# Altium schematic sheet Driver.SchDoc
size 457 x 289 mm
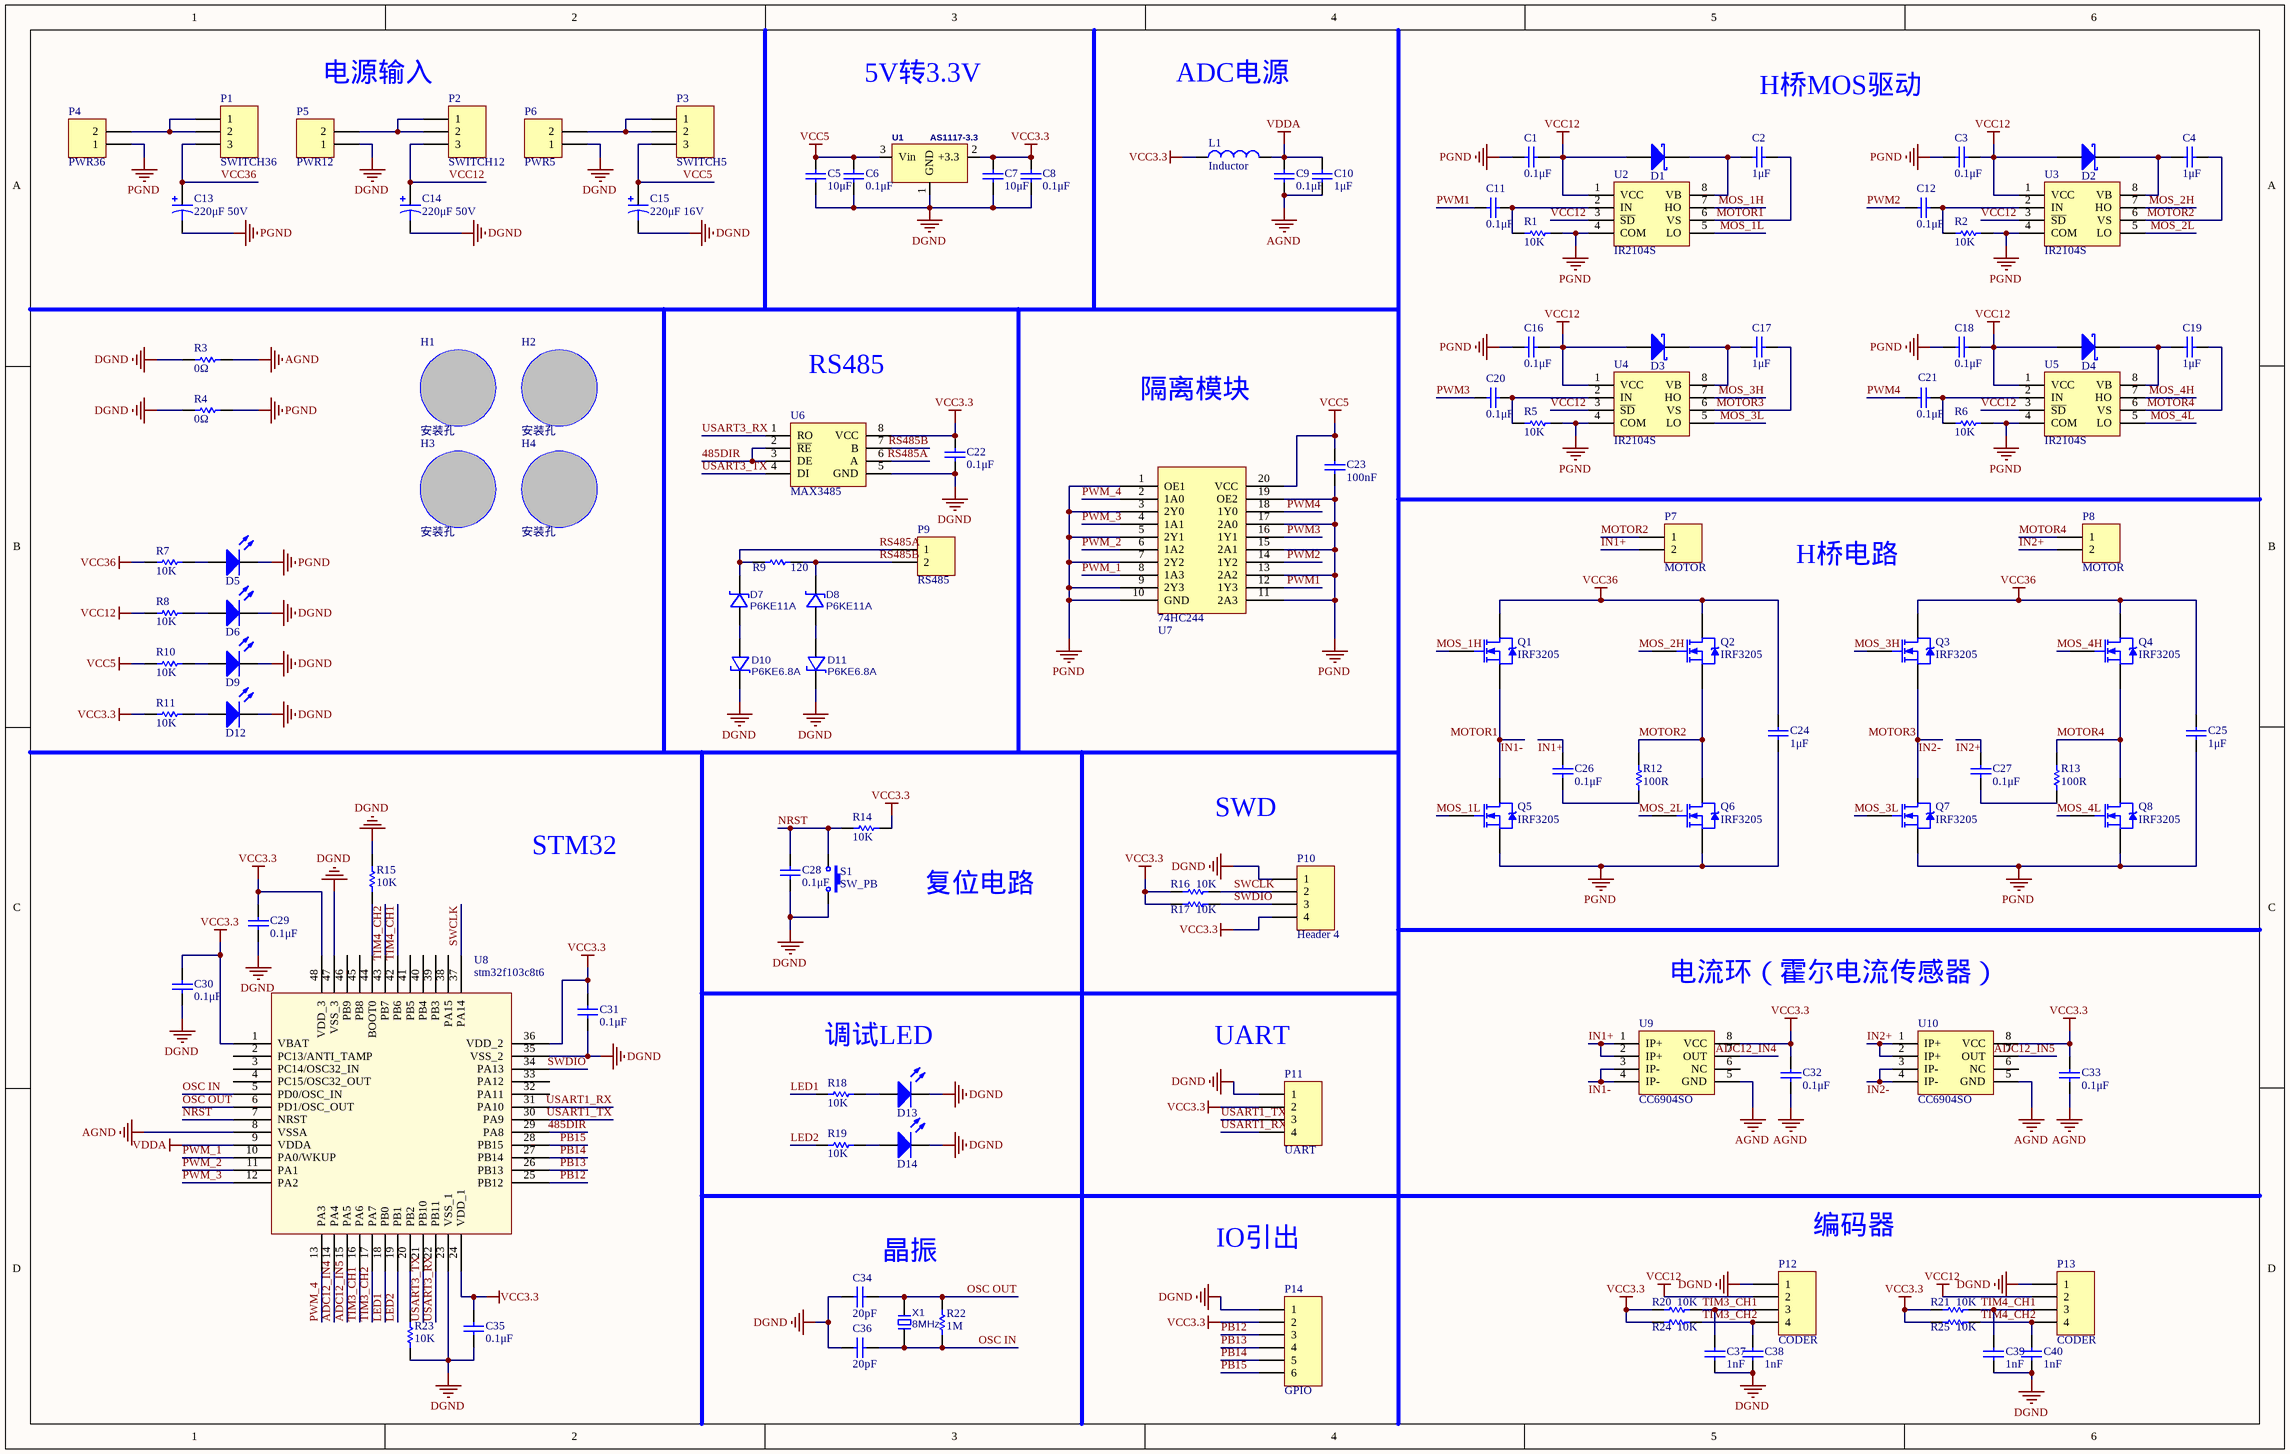
[diagram p0: Driver.SchDoc]

## Parts
C1  0.1μF  [0603C]
C2  1μF  [0603C]
C3  0.1μF  [0603C]
C4  1μF  [0603C]
C5  10μF  [0603C]
C6  0.1μF  [0603C]
C7  10μF  [0603C]
C8  0.1μF  [0603C]
C9  0.1μF  [0603C]
C10  1μF  [0603C]
C11  0.1μF  [0603C]
C12  0.1μF  [0603C]
C13  220μF 50V  [CAP-TH_BD10.0-P5.00-D1.0-FD]
C14  220μF 50V  [CAP-TH_BD10.0-P5.00-D1.0-FD]
C15  220μF 16V  [CAP-TH_BD6.3-P2.50-D1.0-FD]
C16  0.1μF  [0603C]
C17  1μF  [0603C]
C18  0.1μF  [0603C]
C19  1μF  [0603C]
C20  0.1μF  [0603C]
C21  0.1μF  [0603C]
C22  0.1μF  [0603C]
C23  100nF  [0603C]
C24  1μF  [C1206]
C25  1μF  [C1206]
C26  0.1μF  [0603C]
C27  0.1μF  [0603C]
C28  0.1μF  [0603C]
C29  0.1μF  [0603C]
C30  0.1μF  [0603C]
C31  0.1μF  [0603C]
C32  0.1μF  [0603C]
C33  0.1μF  [0603C]
C34  20pF  [0603C]
C35  0.1μF  [0603C]
C36  20pF  [0603C]
C37  1nF  [6-0805_N]
C38  1nF  [6-0805_N]
C39  1nF  [6-0805_N]
C40  1nF  [6-0805_N]
D1  D-SS12  [SMA_L4.4-W2.6-LS5.0-RD]  (value not drawn)
D2  D-SS12  [SMA_L4.4-W2.6-LS5.0-RD]  (value not drawn)
D3  D-SS12  [SMA_L4.4-W2.6-LS5.0-RD]  (value not drawn)
D4  D-SS12  [SMA_L4.4-W2.6-LS5.0-RD]  (value not drawn)
D5  LED_0603  [0603D]  (value not drawn)
D6  LED_0603  [0603D]  (value not drawn)
D7  P6KE11A  [SMB]
D8  P6KE11A  [SMB]
D9  LED_0603  [0603D]  (value not drawn)
D10  P6KE6.8A  [SMB]
D11  P6KE6.8A  [SMB]
D12  LED_0603  [0603D]  (value not drawn)
D13  LED_0603  [0603D]  (value not drawn)
D14  LED_0603  [0603D]  (value not drawn)
H1  安装孔  [安装孔]
H2  安装孔  [安装孔]
H3  安装孔  [安装孔]
H4  安装孔  [安装孔]
L1  Inductor  [0603L]
P1  SWITCH36  [船型开关]
P2  SWITCH12  [钮子开关]
P3  SWITCH5  [SWITCH_SS-12F44]
P4  PWR36  [KF301]
P5  PWR12  [HDR1X2]
P6  PWR5  [HDR1X2]
P7  MOTOR  [KF301]
P8  MOTOR  [KF301]
P9  RS485  [HDR1X2]
P10  Header 4  [HDR1X4]
P11  UART  [HDR1X4]
P12  CODER  [HDR1X4]
P13  CODER  [HDR1X4]
P14  GPIO  [HDR1X6]
Q1  IRF3205  [IRF3205_D2PAK]
Q2  IRF3205  [IRF3205_D2PAK]
Q3  IRF3205  [IRF3205_D2PAK]
Q4  IRF3205  [IRF3205_D2PAK]
Q5  IRF3205  [IRF3205_D2PAK]
Q6  IRF3205  [IRF3205_D2PAK]
Q7  IRF3205  [IRF3205_D2PAK]
Q8  IRF3205  [IRF3205_D2PAK]
R1  10K  [0603R]
R2  10K  [0603R]
R3  0Ω  [0603R]
R4  0Ω  [0603R]
R5  10K  [0603R]
R6  10K  [0603R]
R7  10K  [0603R]
R8  10K  [0603R]
R9  120  [0603R]
R10  10K  [0603R]
R11  10K  [0603R]
R12  100R  [0603R]
R13  100R  [0603R]
R14  10K  [0603R]
R15  10K  [0603R]
R16  10K  [0603R]
R17  10K  [0603R]
R18  10K  [0603R]
R19  10K  [0603R]
R20  10K  [0603R]
R21  10K  [0603R]
R22  1M  [0603R]
R23  10K  [0603R]
R24  10K  [0603R]
R25  10K  [0603R]
S1  SW_PB  [SMD_6MM*3MM]
U1  AS1117-3.3  [SOT223_N]
U2  IR2104S  [SO8_N]
U3  IR2104S  [SO8_N]
U4  IR2104S  [SO8_N]
U5  IR2104S  [SO8_N]
U6  MAX3485  [SO8_N]
U7  74HC244  [SOIC-20_L13.3-W7.5-P1.27-LS7.8-BL]  (value not drawn)
U8  stm32f103c8t6  [STM-LQFP48_N]
U9  CC6904SO  [SO8_N]
U10  CC6904SO  [SO8_N]
X1  8MHz  [HC-49US_L11.5-W4.5-P4.88]

## Nets
AGND: C9.1 C10.1 C32.1 C33.1 R3.1 U8.8(VSSA) U9.5(GND) U10.5(GND)
DGND: C5.1 C6.1 C7.1 C8.1 C14.2 C15.2 C22.2 C28.1 C29.1 C30.1 C31.1 C34.2 C35.1 C36.2 C37.1 C38.1 C39.1 C40.1 D6.2(K) D9.2(K) D10.2(K) D11.2(K) D12.2(K) D13.2(K) D14.2(K) P5.1 P6.1 P10.1 P11.1 P12.1 P13.1 P14.1 R3.2 R4.2 R15.1 R23.2 S1.2 U1.1(GND) U6.5(GND) U8.23(VSS_1) U8.35(VSS_2) U8.47(VSS_3)
PGND: C1.1 C3.1 C13.2 C16.1 C18.1 C23.2 C24.1 C25.1 D5.2(K) P4.1 Q5.3(S) Q6.3(S) Q7.3(S) Q8.3(S) R1.1 R2.1 R4.1 R5.1 R6.1 U2.4(COM) U3.4(COM) U4.4(COM) U5.4(COM) U7.1(OE1) U7.3(2Y0) U7.5(2Y1) U7.7(2Y2) U7.9(2Y3) U7.10(GND) U7.11(2A3) U7.13(2A2) U7.15(2A1) U7.17(2A0) U7.19(OE2)
VCC3.3: C7.2 C8.2 C22.1 C29.2 C30.2 C31.2 C32.2 C33.2 C35.2 L1.1 P10.4 P11.2 P14.2 R11.2 R14.1 R16.1 R17.1 R20.2 R21.2 R24.2 R25.2 U1.2(+3.3) U6.8(VCC) U8.1(VBAT) U8.24(VDD_1) U8.36(VDD_2) U8.48(VDD_3) U9.8(VCC) U10.8(VCC)
VCC5: C5.2 C6.2 C15.1 C23.1 P3.3 R10.2 U1.3(Vin) U7.20(VCC)
VCC12: C1.2 C3.2 C14.1 C16.2 C18.2 D1.1(A) D2.1(A) D3.1(A) D4.1(A) P2.3 P12.2 P13.2 R8.2 U2.1(VCC) U2.3(~{SD}) U3.1(VCC) U3.3(~{SD}) U4.1(VCC) U4.3(~{SD}) U5.1(VCC) U5.3(~{SD})
VCC36: C13.1 C24.2 C25.2 P1.3 Q1.2(D) Q2.2(D) Q3.2(D) Q4.2(D) R7.2
VDDA: C9.2 C10.2 L1.2 U8.9(VDDA)
485DIR: U6.2(~{RE}) U6.3(DE) U8.29(PA8)
ADC12_IN4: U8.14(PA4) U9.7(OUT)
ADC12_IN5: U8.15(PA5) U10.7(OUT)
IN1+: C26.2 P7.2 U9.1(IP+) U9.2(IP+)
IN1-: C2.2 Q1.3(S) Q5.2(D) U2.6(VS) U9.3(IP-) U9.4(IP-)  [also labelled MOTOR1]
IN2+: C27.2 P8.2 U10.1(IP+) U10.2(IP+)
IN2-: C17.2 Q3.3(S) Q7.2(D) U4.6(VS) U10.3(IP-) U10.4(IP-)  [also labelled MOTOR3]
LED1: R18.2 U8.18(PB0)
LED2: R19.2 U8.19(PB1)
MOS_1H: Q1.1(G) U2.7(HO)
MOS_1L: Q5.1(G) U2.5(LO)
MOS_2H: Q2.1(G) U3.7(HO)
MOS_2L: Q6.1(G) U3.5(LO)
MOS_3H: Q3.1(G) U4.7(HO)
MOS_3L: Q7.1(G) U4.5(LO)
MOS_4H: Q4.1(G) U5.7(HO)
MOS_4L: Q8.1(G) U5.5(LO)
MOTOR2: C4.2 P7.1 Q2.3(S) Q6.2(D) R12.2 U3.6(VS)
MOTOR4: C19.2 P8.1 Q4.3(S) Q8.2(D) R13.2 U5.6(VS)
NRST: C28.2 R14.2 S1.1 U8.7(NRST)
OSC IN: C36.1 R22.2 U8.5(PD0/OSC_IN) X1.1
OSC OUT: C34.1 R22.1 U8.6(PD1/OSC_OUT) X1.2
PB12: P14.3 U8.25(PB12)
PB13: P14.4 U8.26(PB13)
PB14: P14.5 U8.27(PB14)
PB15: P14.6 U8.28(PB15)
PWM1: C11.1 U7.12(1Y3)
PWM2: C12.1 U7.14(1Y2)
PWM3: C20.1 U7.16(1Y1)
PWM4: C21.1 U7.18(1Y0)
PWM_1: U7.8(1A3) U8.10(PA0/WKUP)
PWM_2: U7.6(1A2) U8.11(PA1)
PWM_3: U7.4(1A1) U8.12(PA2)
PWM_4: U7.2(1A0) U8.13(PA3)
RS485A: D7.2(K) P9.1 R9.1 U6.6(A)
RS485B: D8.2(K) P9.2 R9.2 U6.7(B)
SWCLK: P10.2 R16.2 U8.37(PA14)
SWDIO: P10.3 R17.2 U8.34(PA13)
TIM3_CH1: C37.2 P12.3 R20.1 U8.16(PA6)
TIM3_CH2: C38.2 P12.4 R24.1 U8.17(PA7)
TIM4_CH1: C39.2 P13.3 R21.1 U8.42(PB6)
TIM4_CH2: C40.2 P13.4 R25.1 U8.43(PB7)
USART1_RX: P11.4 U8.31(PA10)
USART1_TX: P11.3 U8.30(PA9)
USART3_RX: U6.1(RO) U8.22(PB11)
USART3_TX: U6.4(DI) U8.21(PB10)
NetC2_1: C2.1 D1.2(K) U2.8(VB)
NetC4_1: C4.1 D2.2(K) U3.8(VB)
NetC11_2: C11.2 R1.2 U2.2(IN)
NetC12_2: C12.2 R2.2 U3.2(IN)
NetC17_1: C17.1 D3.2(K) U4.8(VB)
NetC19_1: C19.1 D4.2(K) U5.8(VB)
NetC20_2: C20.2 R5.2 U4.2(IN)
NetC21_2: C21.2 R6.2 U5.2(IN)
NetC26_1: C26.1 R12.1
NetC27_1: C27.1 R13.1
NetD5_1: D5.1(A) R7.1
NetD6_1: D6.1(A) R8.1
NetD7_1: D7.1(A) D10.1(A)
NetD8_1: D8.1(A) D11.1(A)
NetD9_1: D9.1(A) R10.1
NetD12_1: D12.1(A) R11.1
NetD13_1: D13.1(A) R18.1
NetD14_1: D14.1(A) R19.1
NetP1_1: P1.1 P1.2 P4.2
NetP2_1: P2.1 P2.2 P5.2
NetP3_1: P3.1 P3.2 P6.2
NetR15_2: R15.2 U8.44(BOOT0)
NetR23_1: R23.1 U8.20(PB2)

Not connected (* = marked no-connect by the designer): U8 2(PC13/ANTI_TAMP) 3(PC14/OSC32_IN) 4(PC15/OSC32_OUT) 32(PA11) 33(PA12) 38(PA15) 39(PB3) 40(PB4) 41(PB5) 45(PB8) 46(PB9); U9 6(NC); U10 6(NC)

## Notes on the sheet
- 电源输入
- 5V转3.3V
- ADC电源
- H桥MOS驱动
- RS485
- 隔离模块
- H桥电路
- SWD
- STM32
- 复位电路
- 电流环（霍尔电流传感器）
- 调试LED
- (near P11) UART
- 晶振
- IO引出
- (near P12) 编码器

## Library data of the parts
C1-C12 C16-C40 = Cap: Capacitor; Published: 8-Jun-2000; LatestRevisionDate: 17-Jul-2002; LatestRevisionNote: Re-released for DXP Platform.; PackageReference: RAD-0.3; Publisher: Altium Limited; PackageDescription: Radial Cap, Thru-Hole; 2 Leads; 0.3 in Pin Spacing
C13-C15 = Cap_A: Capacitor
D7 D8 D10 D11 = P6KE68A: BOM_Manufacturer: RUILON; BOM_Supplier: LCSC; BOM_Manufacturer Part: P6KE68A; BOM_Supplier Part: C10195; spicePre: D; spiceSymbolName: P6KE68A
P1-P3 = Header 3: Header, 3-Pin; LatestRevisionDate: 17-Jul-2002; LatestRevisionNote: Re-released for DXP Platform.; Publisher: Altium Limited
P4-P9 = Header 2: Header, 2-Pin; LatestRevisionDate: 17-Jul-2002; LatestRevisionNote: Re-released for DXP Platform.; Publisher: Altium Limited
P10-P13 = Header 4: Header, 4-Pin; LatestRevisionDate: 17-Jul-2002; LatestRevisionNote: Re-released for DXP Platform.; Publisher: Altium Limited
P14 = Header 6: Header, 6-Pin; LatestRevisionDate: 17-Jul-2002; LatestRevisionNote: Re-released for DXP Platform.; Publisher: Altium Limited
Q1-Q8 = IRF3205: Note: Pin 2 is electrically connected to pin 4.; Published: 8-Jun-2000; LatestRevisionDate: 17-Jul-2002; LatestRevisionNote: Re-released for DXP Platform.; DatasheetDocument: PD-9.814; PackageReference: TO-220AB; Publisher: Altium Limited; Code_JEDEC: TO-220-AB
R1 R2 R5-R8 R10 R11 R14-R21 R23-R25 = Res1: Resistor; Published: 8-Jun-2000; LatestRevisionDate: 17-Jul-2002; LatestRevisionNote: Re-released for DXP Platform.; PackageReference: AXIAL-0.3; Publisher: Altium Limited; PackageDescription: Axial Device, Thru-Hole; 2 Leads; 0.3 in Pin Spacing; Value: 10K
R3 R4 R9 R12 R13 R22 = Res1: Resistor; Value: 10K; Published: 8-Jun-2000; LatestRevisionDate: 17-Jul-2002; LatestRevisionNote: Re-released for DXP Platform.; PackageReference: AXIAL-0.3; Publisher: Altium Limited; PackageDescription: Axial Device, Thru-Hole; 2 Leads; 0.3 in Pin Spacing
S1 = SW_PB: SWITCH
U9 U10 = CC6902SO
X1 = 8MHz: Crystal; BOM_Manufacturer: ZheJiang East Crystal Elec; BOM_Manufacturer Part: B08000J065; nameAlias: Frequency; Contributor: LCSC; BOM_Supplier: LCSC; BOM_Supplier Part: C258976; spicePre: X; spiceSymbolName: B08000J065
D5 D6 D9 D12-D14 = LED_0603: Color: *